# EAGLE board Poppy_IO_Core_v1.1 (EAGLE 7.3.0)
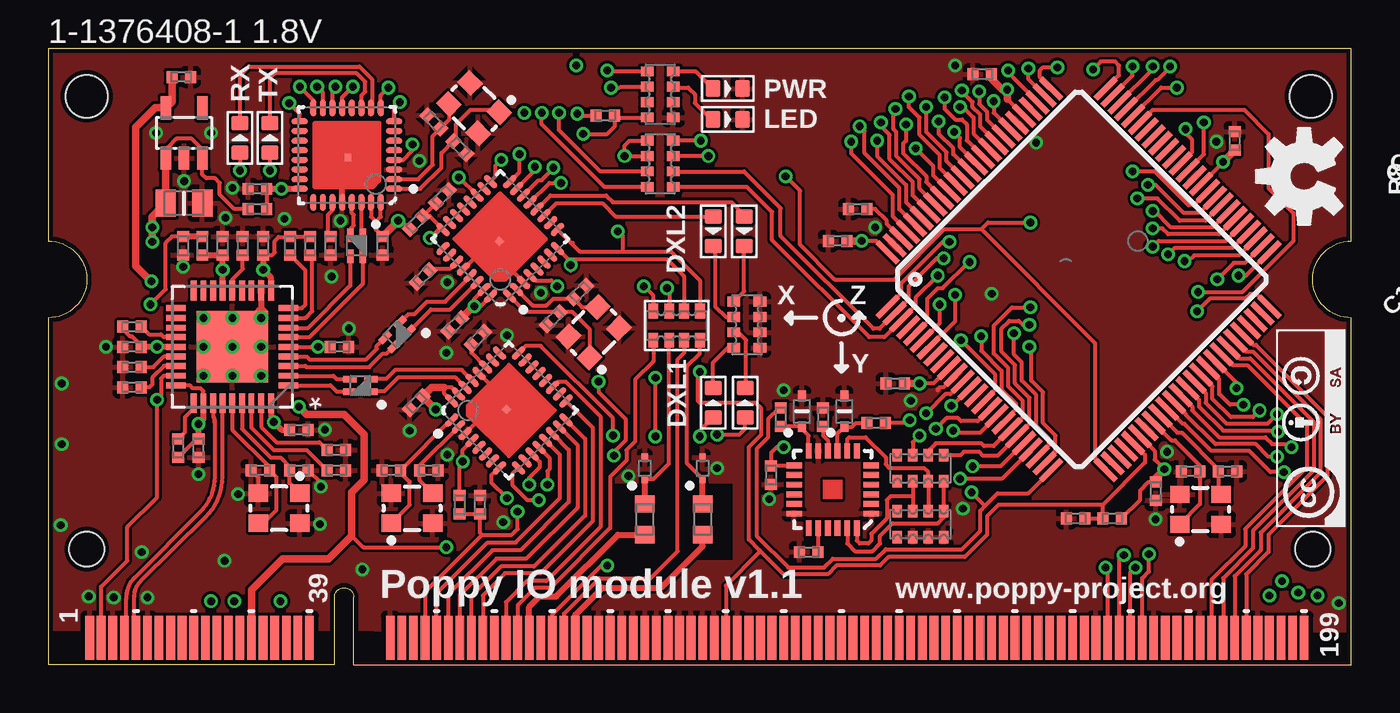
[diagram p2: board, top side]
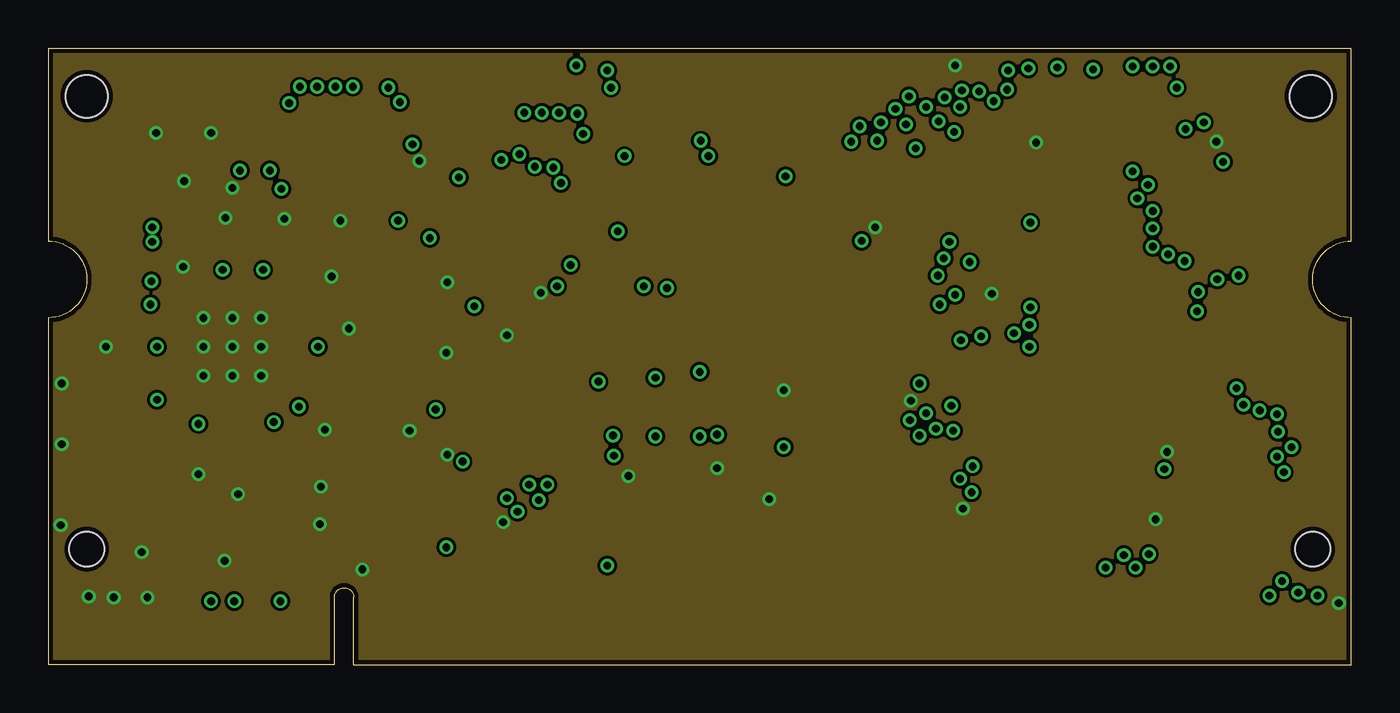
[diagram p3: board, inner layer Route2]
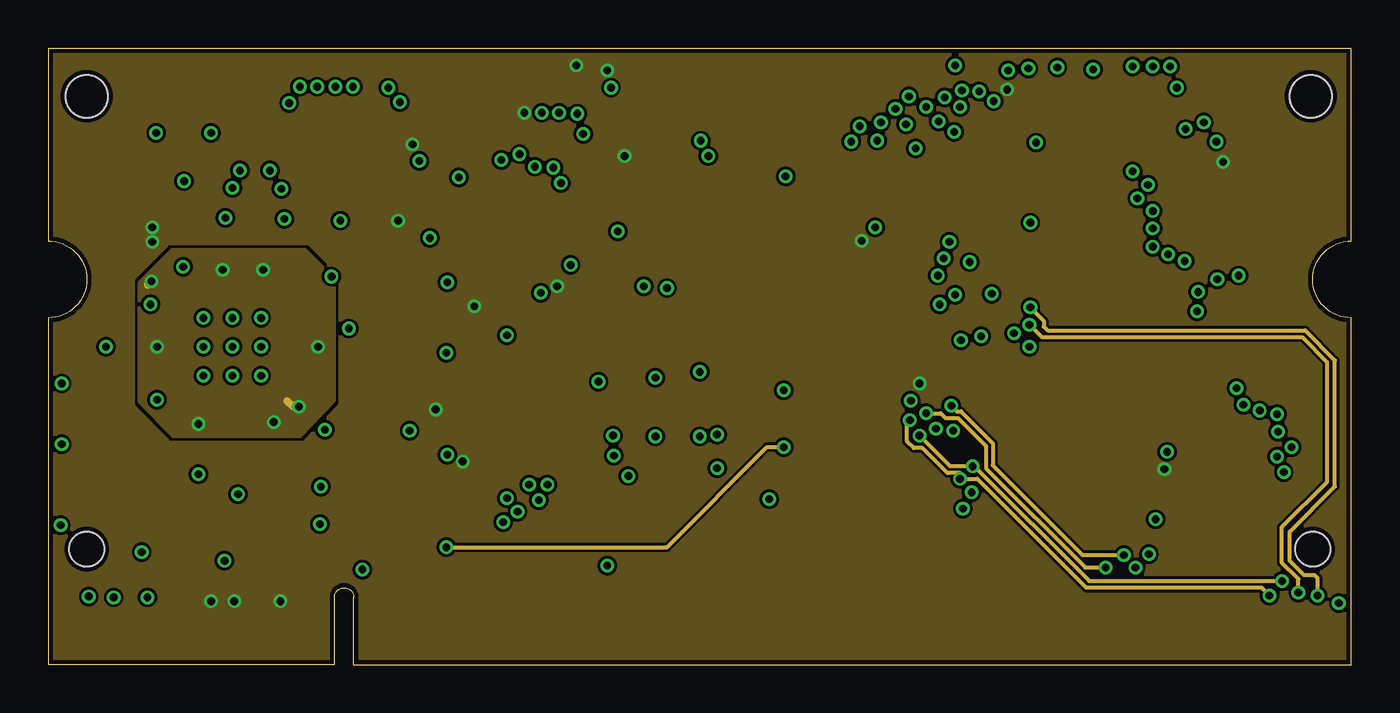
[diagram p4: board, inner layer Route15]
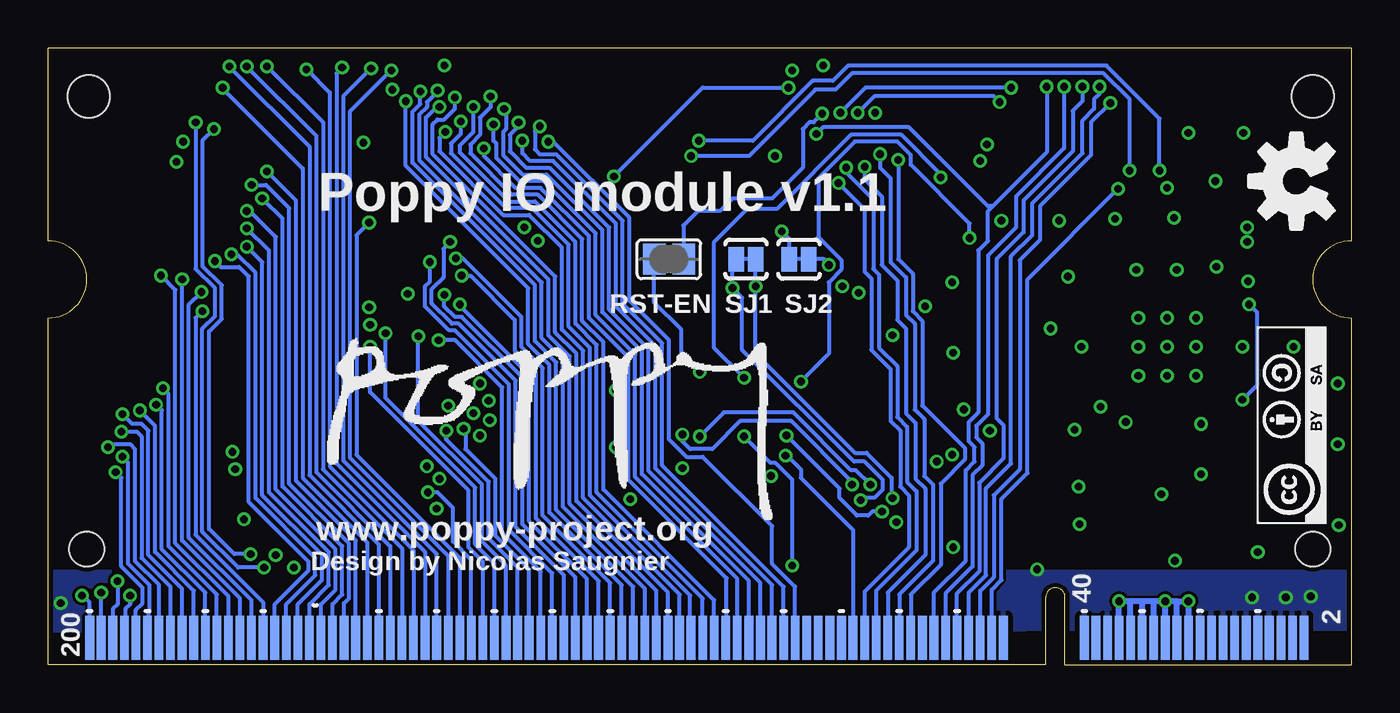
[diagram p5: board, bottom side, seen from below]

Size 67.6 x 32 mm. Coordinates in mm from the lower left corner, seen from the top.
Copper layers (1*2*15*16): Top 0.035mm / dielectric 0.2mm / Route2 0.0175mm / dielectric 1.1mm / Route15 0.0175mm / dielectric 0.2mm / Bottom 0.035mm
Design rules "SeeedStudio_DRU_no_angle_20130527 *": minimum track width 6mil, minimum drill 12mil, track to track 0.15mm, track to pad 0.15mm, pad to pad 0.15mm, via to via 0.15mm, smd to smd 0mil, copper to edge 0.25mm, drill to drill 0.25mm, minimum pad ring 6mil, minimum via ring 6mil, stop-mask expansion 2mil, vias tented up to drill 25mil, thermal gap 10mil
Net classes: 1 power: width 0.61 mm, drill 0.406 mm, clearance 0.203 mm; 2 gnd: width 0.305 mm, drill 0.406 mm, clearance 0.203 mm; 3 power usb: width 0.508 mm, drill 0.406 mm, clearance 0.203 mm
Holes 2.2 mm at 2,29.5 65.5,29.5
tKeepout: area -0.2,27.2 to 4.2,31.8; area 63.2,27.2 to 67.8,31.8
tRestrict: area 29.5,5.5 to 35.5,9.4

## Footprints (pad centres in the part's own frame; a part is rotated, then mirrored left to right if it is on the bottom)
0402_N = smd 0.57 x 0.62: 1 -0.48,0; 2 0.48,0
0805_N = smd 1.05 x 1.4: 1 -0.95,0; 2 0.95,0
SOD-923_N = smd 0.43 x 0.32: A 0.55,0; C -0.55,0
LED0603 = smd 0.762 x 0.889: + -0.762,0; - 0.762,0
SOD-523_N = smd 0.55 x 0.42: A 0.8,0; C -0.8,0
TQFP100 = smd 1.5 x 0.3: 1 -8,6; 2 -8,5.5; 3 -8,5; 4 -8,4.5; 5 -8,4; 6 -8,3.5; 7 -8,3; 8 -8,2.5; 9 -8,2; 10 -8,1.5; 11 -8,1; 12 -8,0.5; 13 -8,0; 14 -8,-0.5; 15 -8,-1; 16 -8,-1.5; 17 -8,-2; 18 -8,-2.5; 19 -8,-3; 20 -8,-3.5; 21 -8,-4; 22 -8,-4.5; 23 -8,-5; 24 -8,-5.5; 25 -8,-6; 51 8,-6; 52 8,-5.5; 53 8,-5; 54 8,-4.5; 55 8,-4; 56 8,-3.5; 57 8,-3; 58 8,-2.5; 59 8,-2; 60 8,-1.5; 61 8,-1; 62 8,-0.5; 63 8,0; 64 8,0.5; 65 8,1; 66 8,1.5; 67 8,2; 68 8,2.5; 69 8,3; 70 8,3.5; 71 8,4; 72 8,4.5; 73 8,5; 74 8,5.5; 75 8,6 | smd 0.3 x 1.5: 26 -6,-8; 27 -5.5,-8; 28 -5,-8; 29 -4.5,-8; 30 -4,-8; 31 -3.5,-8; 32 -3,-8; 33 -2.5,-8; 34 -2,-8; 35 -1.5,-8; 36 -1,-8; 37 -0.5,-8; 38 0,-8; 39 0.5,-8; 40 1,-8; 41 1.5,-8; 42 2,-8; 43 2.5,-8; 44 3,-8; 45 3.5,-8; 46 4,-8; 47 4.5,-8; 48 5,-8; 49 5.5,-8; 50 6,-8; 76 6,8; 77 5.5,8; 78 5,8; 79 4.5,8; 80 4,8; 81 3.5,8; 82 3,8; 83 2.5,8; 84 2,8; 85 1.5,8; 86 1,8; 87 0.5,8; 88 0,8; 89 -0.5,8; 90 -1,8; 91 -1.5,8; 92 -2,8; 93 -2.5,8; 94 -3,8; 95 -3.5,8; 96 -4,8; 97 -4.5,8; 98 -5,8; 99 -5.5,8; 100 -6,8
SOT23-DBV = smd 0.55 x 1.2: 1 -0.95,-1.3; 2 0,-1.3; 3 0.95,-1.3; 4 0.95,1.3; 5 -0.95,1.3
CRYSTAL_MODEL-403_N = smd 1 x 0.9: P$1 -1.05,-0.75; P$2 1.1,-0.75; P$3 1.1,0.8; P$4 -1.05,0.8
ARRAY_0402_65P_2_N = smd 0.7 x 0.35: 1 -0.55,0.325; 2 -0.55,-0.325; 3 0.55,-0.325; 4 0.55,0.325
R1206-8 = smd 0.508 x 0.762: 1 -1.206,-0.762; 2 -0.381,-0.762; 3 0.381,-0.762; 4 1.206,-0.762; 5 1.206,0.762; 6 0.381,0.762; 7 -0.381,0.762; 8 -1.206,0.762
SJ = smd 1.168 x 1.6: 1 -0.762,0; 2 0.762,0
CAY16 = smd 0.5 x 0.65: 1 -1.2,-0.675; 2 -0.4,-0.675; 3 0.4,-0.675; 4 1.2,-0.675; 5 1.2,0.675; 6 0.4,0.675; 7 -0.4,0.675; 8 -1.2,0.675
CAT16 = smd 0.5 x 0.65: 1 -1.2,-0.675; 2 -0.4,-0.675; 3 0.4,-0.675; 4 1.2,-0.675; 5 1.2,0.675; 6 0.4,0.675; 7 -0.4,0.675; 8 -1.2,0.675
0603_N = smd 0.9 x 1: 1 -0.8,0; 2 0.8,0
SJ_2S-TRACE2 = smd 0.8 x 1.27: 1 -0.508,0; 2 0.508,0
QFN-32_50P_N = smd 0.85 x 0.3: 1 -2.45,1.75; 2 -2.45,1.25; 3 -2.45,0.75; 4 -2.45,0.25; 5 -2.45,-0.25; 6 -2.45,-0.75; 7 -2.45,-1.25; 8 -2.45,-1.75; 17 2.45,-1.75; 18 2.45,-1.25; 19 2.45,-0.75; 20 2.45,-0.25; 21 2.45,0.25; 22 2.45,0.75; 23 2.45,1.25; 24 2.45,1.75 | smd 0.3 x 0.85: 9 -1.75,-2.45; 10 -1.25,-2.45; 11 -0.75,-2.45; 12 -0.25,-2.45; 13 0.25,-2.45; 14 0.75,-2.45; 15 1.25,-2.45; 16 1.75,-2.45; 25 1.75,2.45; 26 1.25,2.45; 27 0.75,2.45; 28 0.25,2.45; 29 -0.25,2.45; 30 -0.75,2.45; 31 -1.25,2.45; 32 -1.75,2.45 | smd 0.35 x 0.35: 33 -0.05,0.13
QFN-24 = smd 0.8 x 0.3: 1 -2,1.25; 2 -2,0.75; 3 -2,0.25; 4 -2,-0.25; 5 -2,-0.75; 6 -2,-1.25; 13 2,-1.25; 14 2,-0.75; 15 2,-0.25; 16 2,0.25; 17 2,0.75; 18 2,1.25 | smd 0.3 x 0.8: 7 -1.25,-2; 8 -0.75,-2; 9 -0.25,-2; 10 0.25,-2; 11 0.75,-2; 12 1.25,-2; 19 1.25,2; 20 0.75,2; 21 0.25,2; 22 -0.25,2; 23 -0.75,2; 24 -1.25,2
QFN50P600X600X100-37N = smd 1.016 x 0.305: 1 -2.921,2.007; 2 -2.921,1.499; 3 -2.921,0.991; 4 -2.921,0.508; 5 -2.921,0; 6 -2.921,-0.508; 7 -2.921,-0.991; 8 -2.921,-1.499; 9 -2.921,-2.007; 19 2.921,-2.007; 20 2.921,-1.499; 21 2.921,-0.991; 22 2.921,-0.508; 23 2.921,0; 24 2.921,0.508; 25 2.921,0.991; 26 2.921,1.499; 27 2.921,2.007 | smd 0.305 x 1.016: 10 -2.007,-2.921; 11 -1.499,-2.921; 12 -0.991,-2.921; 13 -0.508,-2.921; 14 0,-2.921; 15 0.508,-2.921; 16 0.991,-2.921; 17 1.499,-2.921; 18 2.007,-2.921; 28 2.007,2.921; 29 1.499,2.921; 30 0.991,2.921; 31 0.508,2.921; 32 0,2.921; 33 -0.508,2.921; 34 -0.991,2.921; 35 -1.499,2.921; 36 -2.007,2.921 | smd 3.708 x 3.708: 37 0,0
DDR1 = smd 0.45 x 2.3: 1 2.15,1.4; 3 2.75,1.4; 5 3.35,1.4; 7 3.95,1.4; 9 4.55,1.4; 11 5.15,1.4; 13 5.75,1.4; 15 6.35,1.4; 17 6.95,1.4; 19 7.55,1.4; 21 8.15,1.4; 23 8.75,1.4; 25 9.35,1.4; 27 9.95,1.4; 29 10.55,1.4; 31 11.15,1.4; 33 11.75,1.4; 35 12.35,1.4; 37 12.95,1.4; 39 13.55,1.4; 41 17.75,1.4; 43 18.35,1.4; 45 18.95,1.4; 47 19.55,1.4; 49 20.15,1.4; 51 20.75,1.4; 53 21.35,1.4; 55 21.95,1.4; 57 22.55,1.4; 59 23.15,1.4; 61 23.75,1.4; 63 24.35,1.4; 65 24.95,1.4; 67 25.55,1.4; 69 26.15,1.4; 71 26.75,1.4; 73 27.35,1.4; 75 27.95,1.4; 77 28.55,1.4; 79 29.15,1.4; 81 29.75,1.4; 83 30.35,1.4; 85 30.95,1.4; 87 31.55,1.4; 89 32.15,1.4; 91 32.75,1.4; 93 33.35,1.4; 95 33.95,1.4; 97 34.55,1.4; 99 35.15,1.4; 101 35.75,1.4; 103 36.35,1.4; 105 36.95,1.4; 107 37.55,1.4; 109 38.15,1.4; 111 38.75,1.4; 113 39.35,1.4; 115 39.95,1.4; 117 40.55,1.4; 119 41.15,1.4; 121 41.75,1.4; 123 42.35,1.4; 125 42.95,1.4; 127 43.55,1.4; 129 44.15,1.4; 131 44.75,1.4; 133 45.35,1.4; 135 45.95,1.4; 137 46.55,1.4; 139 47.15,1.4; 141 47.75,1.4; 143 48.35,1.4; 145 48.95,1.4; 147 49.55,1.4; 149 50.15,1.4; 151 50.75,1.4; 153 51.35,1.4; 155 51.95,1.4; 157 52.55,1.4; 159 53.15,1.4; 161 53.75,1.4; 163 54.35,1.4; 165 54.95,1.4; 167 55.55,1.4; 169 56.15,1.4; 171 56.75,1.4; 173 57.35,1.4; 175 57.95,1.4; 177 58.55,1.4; 179 59.15,1.4; 181 59.75,1.4; 183 60.35,1.4; 185 60.95,1.4; 187 61.55,1.4; 189 62.15,1.4; 191 62.75,1.4; 193 63.35,1.4; 195 63.95,1.4; 197 64.55,1.4; 199 65.15,1.4 | smd 0.45 x 2.3 bottom: 2 2.45,1.4; 4 3.05,1.4; 6 3.65,1.4; 8 4.25,1.4; 10 4.85,1.4; 12 5.45,1.4; 14 6.05,1.4; 16 6.65,1.4; 18 7.25,1.4; 20 7.85,1.4; 22 8.45,1.4; 24 9.05,1.4; 26 9.65,1.4; 28 10.25,1.4; 30 10.85,1.4; 32 11.45,1.4; 34 12.05,1.4; 36 12.65,1.4; 38 13.25,1.4; 40 13.85,1.4; 42 18.05,1.4; 44 18.65,1.4; 46 19.25,1.4; 48 19.85,1.4; 50 20.45,1.4; 52 21.05,1.4; 54 21.65,1.4; 56 22.25,1.4; 58 22.85,1.4; 60 23.45,1.4; 62 24.05,1.4; 64 24.65,1.4; 66 25.25,1.4; 68 25.85,1.4; 70 26.45,1.4; 72 27.05,1.4; 74 27.65,1.4; 76 28.25,1.4; 78 28.85,1.4; 80 29.45,1.4; 82 30.05,1.4; 84 30.65,1.4; 86 31.25,1.4; 88 31.85,1.4; 90 32.45,1.4; 92 33.05,1.4; 94 33.65,1.4; 96 34.25,1.4; 98 34.85,1.4; 100 35.45,1.4; 102 36.05,1.4; 104 36.65,1.4; 106 37.25,1.4; 108 37.85,1.4; 110 38.45,1.4; 112 39.05,1.4; 114 39.65,1.4; 116 40.25,1.4; 118 40.85,1.4; 120 41.45,1.4; 122 42.05,1.4; 124 42.65,1.4; 126 43.25,1.4; 128 43.85,1.4; 130 44.45,1.4; 132 45.05,1.4; 134 45.65,1.4; 136 46.25,1.4; 138 46.85,1.4; 140 47.45,1.4; 142 48.05,1.4; 144 48.65,1.4; 146 49.25,1.4; 148 49.85,1.4; 150 50.45,1.4; 152 51.05,1.4; 154 51.65,1.4; 156 52.25,1.4; 158 52.85,1.4; 160 53.45,1.4; 162 54.05,1.4; 164 54.65,1.4; 166 55.25,1.4; 168 55.85,1.4; 170 56.45,1.4; 172 57.05,1.4; 174 57.65,1.4; 176 58.25,1.4; 178 58.85,1.4; 180 59.45,1.4; 182 60.05,1.4; 184 60.65,1.4; 186 61.25,1.4; 188 61.85,1.4; 190 62.45,1.4; 192 63.05,1.4; 194 63.65,1.4; 196 64.25,1.4; 198 64.85,1.4; 200 65.45,1.4 | hole 1.8: 2,6; 65.6,6

## Placement (x,y rotation side)
C1  1uF  [0402_N]  21.1,17.65 225 top
C2  1uF  [0402_N]  57.45,9 270 top
C3  0.1uF  [0402_N]  42,23.65 0 top
C4  1uF  [0402_N]  22.3,16.95 45 top
C5  18pF  [0402_N]  17.8,10.1 0 top
C6  18pF  [0402_N]  19.75,10.1 180 top
C7  1uF  [0402_N]  19.45,20.15 225 top
C8  1uF  [0402_N]  61.55,27.2 90 top
C9  1uF  [0402_N]  40.95,22 180 top
C10  18pF  [0402_N]  53.3,7.6 180 top
C11  4.7uF  [0805_N]  7.05,23.95 0 top
C12  1uF  [0402_N]  17.35,21.75 270 top
C13  1uF  [0402_N]  6.9,30.5 0 top
C14  0.1uF  [0402_N]  28.9,28.5 180 top
C15  18pF  [0402_N]  26.21,17.97 45 top
C16  18pF  [0402_N]  27.59,19.34 225 top
C17  1uF  [0402_N]  14.65,21.75 90 top
C18  18pF  [0402_N]  21.35,26.84 315 top
C19  18pF  [0402_N]  20.01,28.18 135 top
C20  1uF  [0402_N]  19.1,13.6 225 top
C21  1uF  [0402_N]  37.5,9.85 270 top
C22  2.2nF  [0402_N]  39.45,5.85 180 top
C23  0.1uF  [0402_N]  40.2,12.85 90 top
C24  18pF  [0402_N]  61.18,10.05 0 top
C25  18pF  [0402_N]  59.26,10.05 180 top
C26  18pF  [0402_N]  11,10.1 180 top
C27  18pF  [0402_N]  13,10.1 180 top
C28  1uF  [0402_N]  11.15,21.75 90 top
C29  0.1uF  [0402_N]  14.95,10.1 0 top
C30  0.1uF  [0402_N]  10.1,21.75 90 top
C31  1uF  [0402_N]  7.8,11.25 270 top
C32  1uF  [0402_N]  4.35,16.5 180 top
C33  1uF  [0402_N]  9.05,21.75 90 top
C34  1uF  [0402_N]  15.1,16.5 0 top
C35  1uF  [0402_N]  13,12.2 0 top
C36  1uF  [0402_N]  7,21.75 270 top
C37  1uF  [0402_N]  43.95,14.6 180 top
C38  1uF  [0402_N]  48.45,30.65 180 top
C39  1uF  [0402_N]  10.85,24.7 180 top
C40  0.1uF  [0402_N]  20.45,24.3 45 top
C41  0.1uF  [0402_N]  22.4,8.3 90 top
D1  5.1V  [SOD-923_N]  30.95,10.2 90 top
D2  Red  [LED0603]  36.15,13.6 90 top
D3  Green  [LED0603]  34.5,13.6 90 top
D4  5.1V  [SOD-923_N]  33.95,10.2 90 top
D5  Yellow  [LED0603]  9.95,27.35 90 top
D6  Yellow  [LED0603]  11.5,27.35 90 top
D7  Red  [LED0603]  36.1,22.5 270 top
D8  Green  [LED0603]  34.5,22.5 270 top
D9  Yellow  [LED0603]  35.25,28.3 0 top
D10  Blue  [LED0603]  35.25,29.9 0 top
D11  3.3V  [SOD-523_N]  41.3,13.15 90 top
D12  3.3V  [SOD-523_N]  39.1,13.15 90 top
IC3  ATMEGA2560-16AU  [TQFP100]  53.45,20 45 top
IC6  LP2985-33DBVR  [SOT23-DBV]  7.05,27.6 0 top
Q1  16MHz  [CRYSTAL_MODEL-403_N]  18.85,8.1 0 top
Q2  16MHz  [CRYSTAL_MODEL-403_N]  59.75,8.04 0 top
Q3  16MHz  [CRYSTAL_MODEL-403_N]  22.13,28.89 135 top
Q4  16MHz  [CRYSTAL_MODEL-403_N]  28.29,17.22 45 top
Q5  24MHz  [CRYSTAL_MODEL-403_N]  12,8.15 180 top
R1  22R  [ARRAY_0402_65P_2_N]  16.2,14.5 180 top
R2  150R  [R1206-8]  32.6,17.6 180 top
R3  22R  [ARRAY_0402_65P_2_N]  18.1,17.15 225 top
R4  470R  [0402_N]  42.95,12.55 0 top
R5  10k  [0402_N]  12.55,21.75 90 top
R6  12k 1%  [0402_N]  14.95,11.15 0 top
R7  10k  [0402_N]  13.6,21.75 270 top
R8  100k  [0402_N]  8,21.75 90 top
R9  100k  [0402_N]  6.75,11.25 90 top
R10  100k  [0402_N]  4.35,17.55 0 top
R11  100k  [0402_N]  4.35,14.4 180 top
R12  100k  [0402_N]  4.35,15.45 0 top
R13  22R  [ARRAY_0402_65P_2_N]  16,21.75 270 top
R14  470R  [0402_N]  38,12.85 90 top
R15  10k  [0402_N]  55.2,7.6 180 top
R16  10k  [0402_N]  21.35,8.3 270 top
R17  10k  [0402_N]  19.1,22.95 45 top
R18  10k  [0402_N]  10.85,23.65 0 top
RESET-EN  [SJ]  35.4,21.05 0 bottom
RN1  1k  [CAY16]  36.25,17.65 90 top
RN2  10K  [CAT16]  45.25,10.2 0 top
RN3  1k  [CAY16]  31.75,29.6 270 top
RN4  1k  [CAY16]  31.75,26 90 top
RN6  20K  [CAT16]  45.25,7.3 180 top
RPTC1  100R  [0603_N]  30.95,7.55 270 top
RPTC2  100R  [0603_N]  33.95,7.55 270 top
SJ1  SOLDERJUMPER2_TRACE2  [SJ_2S-TRACE2]  31.4,21.05 180 bottom
SJ2  SOLDERJUMPER2_TRACE2  [SJ_2S-TRACE2]  28.65,21.05 180 bottom
U1  ATmega16u2  [QFN-32_50P_N]  23.9,13.2 45 top
U2  MPU-6000  [QFN-24]  40.7,9.1 180 top
U3  USB2514B-AEZC  [QFN50P600X600X100-37N]  9.55,16.5 180 top
U4  ATmega16u2  [QFN-32_50P_N]  23.45,22.1 135 top
U5  ATmega16u2  [QFN-32_50P_N]  15.5,26.45 180 top
U$1  [OSHW-LOGO-M]  65.15,25.35 90 top
U$2  [CC-BY-SA]  65.05,12.45 90 top
U$3  [OSHW-LOGO-M]  2.85,25.1 90 bottom
U$4  [CC-BY-SA]  3.55,12.6 90 bottom
X1  1376408-DDR1  [DDR1]  0,0 0 top

## Tracks (layer width: path | path; a pad name or v marks a point on that pad's centre or on a via)
!CS_3V3
  Top 0.2: U2.8 41.45,11.7 41.55,11.8 42.4,11.8 43.45,10.75 43.45,10.4 43.65,10.2 45.45,10.2 45.65,10 RN2.3 RN6.2
+3V3  (via drill 0.4)
  Top 0.2: U3.5 v14,16.5 C34.1 | C28.1 11.62,21.27 11.75,21.4 11.75,22 11.95,22.2 12.52,22.2 R5.2 R7.1 | U3.29 8.05,14.2 7.9,14.35 7.5,14.35 7.36,14.49 U3.27 | R10.1 3.87,17.43 4.25,17.05 4.35,17.05 4.83,16.57 C32.1 | R9.1 7.71,11.73 C31.1 | 15.75,6.7 16.35,6.1 v20.65,6.1 | U2.13 38.68,10.33 C21.1 37.5,11 37.8,11.3 v38.15,11.3
  Top 0.3: R8.1 C33.1 v9.05,20.5 v9.04,20.49 U3.15 | U3.10 11.56,20.09 v11.15,20.5 C28.1 | U3.23 v5.65,16.5 C32.1 | C31.1 v7.8,12.5 8.05,12.75 U3.29 | U3.36 11.56,12.74 v11.7,12.6 12.1,12.2 C35.1
  Top 0.4: X1.29 10.55,3.9 12.15,5.5 14.55,5.5 15.75,6.7 15.75,8.95 16.4,9.6 16.4,11.95 15.35,13 13.4,13 v13,13.4 | C13.1 6.42,29.22 IC6.5 5.55,28.9 4.55,27.9 4.55,20.7 v5.35,19.9
  Route15 0.2: v20.65,6.1 32.1,6.1 37.3,11.3 v38.15,11.3
  Route15 0.4: v13,13.4 12.7,13.4 12.4,13.7 | v5.35,19.9 5.3,19.9 5.15,19.75 5.15,19.7
  pour Route15: 6.45,21.55 13.3,21.55 14.8,20.05 14.8,13.7 13.05,11.85 6.5,11.85 4.75,13.65 4.75,19.85
+5V  (via drill 0.4)
  Top 0.2: 19.44,13.91 C20.1 | U1.32 20.55,14.07 20.55,14.4 20.93,14.4 U1.31 | U1.4 21.5,11.15 v21.5,10.55 21.35,10.4 R16.1 | U4.31 22.1,18.98 v22.1,18.6 22.43,18.6 U4.32 | U4.4 25.25,19.95 26.1,19.95 v26.4,19.65 | IC6.1 6.2,26.4 6.2,26.85 6.65,27.3 7.45,27.3 8,26.75 IC6.3 8,25.45 8.2,25.25 8.65,25.25 8.9,25 8.9,24.4 9.65,23.65 R18.1 | U5.31 16.75,23.25 17,23 | 17,23 17.25,23.25 U5.32 | C12.1 17,22.58 17,23 | U5.4 18.4,26.2 18.9,26.7 v18.9,27 | 18.15,23.03 18.34,23.03 R17.1 | IC3.31 57.4,11.1 57.4,10.65 v57.9,10.15 | IC3.10 45.93,14.6 v45.2,14.6 | IC3.100 42.97,22 v42.2,22 | IC3.80 49.76,29.35 | IC3.61 60.95,26.09 v60.95,26.1 | R15.1 56.65,8.57 56.65,9.05 57.08,9.48 C2.1 | RN4.6 v29.9,26.4 29.9,26.95 30.15,27.2 RN4.5 | v29,30.85 29.05,30.8 RN3.1
  Top 0.4: C20.1 19.9,14.4 20.55,14.4 | 19.44,13.91 v20.1,13.25 | v22.1,18.6 22.05,18.6 C1.1 | IC6.1 C11.1 5.4,23.25 v5.4,22.7 v5.4,21.95 | C12.1 18.15,23.03 v18.15,23.05 | C2.1 57.45,9.7 v57.9,10.15 | C8.1 61.55,26.7 v60.95,26.1 | v42.2,22 C9.1 | v45.2,14.6 C37.1 | 49.76,29.35 v49.76,29.84 v49.75,29.85 49.5,29.85 48.95,30.4 48.95,30.63 C38.1
  Bottom 0.3: X1.34 v12.05,3.3 11.45,3.3 | X1.32 11.45,3.3 | X1.30 10.85,3.3 | X1.28 10.25,3.3 | X1.26 v9.65,3.3 | X1.24 9.05,3.3 | 9.05,3.3 v8.45,3.3 X1.22 | 9.05,3.3 v9.65,3.3 | v9.65,3.3 10.25,3.3 | 10.25,3.3 10.85,3.3 | 10.85,3.3 11.45,3.3
  other vias: 27.4,31.1 24.7,28.65
  pour Route15 (rank 2): 0,31.75 67.6,31.75 67.6,0 0,0
ADC0  (via drill 0.4)
  Top 0.2: v41.65,27.15 41.65,26.55 43.8,24.4 43.8,23.29 IC3.97
  Bottom 0.2: X1.78 28.85,4.05 30.05,5.25 30.05,7.2 33.65,10.8 34.5,10.8 35.4,11.7 35.4,16.85 37.45,18.9 37.45,23.2 41.4,27.15 v41.65,27.15
ADC1  (via drill 0.4)
  Top 0.2: IC3.96 44.15,23.64 44.15,24.75 42.35,26.55 42.35,27.7 v42.1,27.95
  Bottom 0.2: X1.80 29.45,4.05 35.75,10.35 35.75,16.7 37.8,18.75 37.8,23.05 41.25,26.5 42.1,26.5 42.35,26.75 42.35,27.7 v42.1,27.95
ADC2  (via drill 0.4)
  Top 0.2: v43,27.2 43,26.4 44.5,24.9 44.5,24 IC3.95
  Bottom 0.2: X1.82 30.05,4.15 36.1,10.2 36.1,16.55 38.15,18.6 38.15,22.9 41.4,26.15 42.6,26.15 43,26.55 v43,27.2
ADC3  (via drill 0.4)
  Top 0.2: IC3.94 44.85,24.36 44.85,25.05 43.65,26.25 43.65,27.5 43.2,27.95 v43.2,28.15
  Bottom 0.2: X1.84 30.65,4.25 36.45,10.05 36.45,16.4 38.5,18.45 38.5,22.7 41.6,25.8 42.8,25.8 43.65,26.65 43.65,27.5 43.2,27.95 v43.2,28.15
ADC4  (via drill 0.4)
  Top 0.2: IC3.93 45.2,24.71 45.2,25.2 44,26.4 44,27.65 43.85,27.8 43.85,28.5 43.95,28.6 v43.95,28.85
  Bottom 0.2: X1.86 31.25,4.35 36.8,9.9 36.8,16.25 38.85,18.3 38.85,22.55 41.75,25.45 43,25.45 44,26.45 44,27.65 43.85,27.8 43.85,28.75 v43.95,28.85
ADC5  (via drill 0.4)
  Top 0.2: v44.5,28.05 44.5,27.2 44.35,27.05 44.35,26.55 45.55,25.35 45.55,25.05 46.36,24.24 IC3.92
  Bottom 0.2: X1.88 31.85,4.45 37.15,9.75 37.15,16.1 39.2,18.15 39.2,22.4 41.9,25.1 43.15,25.1 44.35,26.3 44.35,27.05 44.5,27.2 v44.5,28.05
ADC6  (via drill 0.4)
  Top 0.2: v45,26.8 45.9,25.9 45.9,25.4 46.7,24.6 IC3.91
  Bottom 0.2: X1.90 32.4,1.45 32.4,4.5 37.5,9.6 37.5,15.95 39.55,18 39.55,22.25 42.05,24.75 43.35,24.75 45,26.4 v45,26.8
ADC7  (via drill 0.4)
  Top 0.2: IC3.90 46.25,25.79 46.25,26.45 45.2,27.5 45.2,28.4 44.65,28.95 v44.65,29.5
  Bottom 0.2: X1.92 33.05,3.35 38.8,9.1 38.8,16.75 39.9,17.85 39.9,22.1 42.2,24.4 43.55,24.4 45.7,26.55 45.7,27 45.2,27.5 45.2,28.4 44.65,28.95 v44.65,29.5
ADC8  (via drill 0.4)
  Top 0.2: IC3.89 46.6,26.14 46.6,26.6 45.55,27.65 v45.55,28.95
  Bottom 0.2: X1.94 33.65,3.45 39.15,8.95 39.15,16.6 40.25,17.7 40.25,21.95 42.35,24.05 43.7,24.05 46.25,26.6 46.25,26.95 45.55,27.65 v45.55,28.95
ADC9  (via drill 0.4)
  Top 0.2: IC3.88 46.95,26.5 46.95,26.8 46.2,27.55 v46.2,28.2
  Bottom 0.2: X1.96 34.3,1.45 34.3,3.6 39.5,8.8 39.5,16.45 40.6,17.55 40.6,21.8 42.5,23.7 43.85,23.7 46.7,26.55 46.7,27.05 46.2,27.55 v46.2,28.2
ADC10  (via drill 0.4)
  Top 0.2: IC3.87 47.3,26.86 47.3,27.35 v47,27.65
  Bottom 0.2: X1.98 34.85,3.65 39.85,8.65 39.85,16.3 40.95,17.4 40.95,21.65 42.65,23.35 44,23.35 47.3,26.65 47.3,27.35 v47,27.65
ADC11  (via drill 0.4)
  Top 0.2: v46.5,29.45 46.5,28.85 47.05,28.3 47.4,28.3 47.65,28.05 47.65,27.21 IC3.86
  Bottom 0.2: X1.100 35.45,3.75 40.2,8.5 40.2,16.15 41.3,17.25 41.3,20.15 47.65,26.5 47.65,28.05 47.4,28.3 47.05,28.3 46.5,28.85 v46.5,29.45
ADC12  (via drill 0.4)
  Top 0.2: v47.3,28.95 47.45,28.95 48,28.4 48,27.57 IC3.85
  Bottom 0.2: X1.102 36.05,3.85 40.55,8.35 40.55,16 41.65,17.1 41.65,20 48,26.35 48,28.4 47.45,28.95 v47.3,28.95
ADC13  (via drill 0.4)
  Top 0.2: IC3.84 48.35,27.93 48.35,28.55 47.95,28.95 47.95,29.2 47.4,29.75 v47.4,29.8
  Bottom 0.2: X1.104 36.65,3.95 40.9,8.2 40.9,15.85 42,16.95 42,19.85 48.35,26.2 48.35,28.55 47.95,28.95 47.95,29.2 47.4,29.75 v47.4,29.8
ADC14  (via drill 0.4)
  Top 0.2: v48.3,29.75 48.3,29.1 48.7,28.7 48.7,28.29 IC3.83
  Bottom 0.2: X1.106 37.25,4.05 41.25,8.05 41.25,15.7 42.35,16.8 42.35,19.7 48.7,26.05 48.7,28.7 48.3,29.1 v48.3,29.75
ADC15  (via drill 0.4)
  Top 0.2: v49.05,29.25 49.05,28.64 IC3.82
  Bottom 0.2: X1.108 37.85,4.15 41.6,7.9 41.6,15.55 42.7,16.65 42.7,19.55 49.05,25.9 v49.05,29.25
AREF
  Top 0.2: IC3.98 43.5,22.88 43.5,23.05 42.9,23.65 C3.2
GND  (via drill 0.4)
  Top 0.2: v11.05,18 U3.37 | C26.2 10.9,9.72 Q5.P$2 | C27.1 14.15,9.43 v14.15,9.25 | U1.28 23.77,13.68 U1.33 | U1.3 22.59,12.95 22.8,12.95 | U4.28 22.97,21.97 U4.33 23.39,21.11 24.7,19.8 | IC3.11 46.44,14.4 46.25,14.4 46.15,14.3 46.15,14.25
  Top 0.3: U3.11 11.05,18.45 | 11.05,18.45 11.05,18.35 10.75,18.05 10.75,17.7 U3.37 | 11.05,18.45 11.1,18.45 11.25,18.3 | 11.05,18.45 11,18.45 10.75,18.2 | U5.28 15.25,26.02 U5.33
  other vias: 16.3,4.95 2.1,3.55 15.6,17.45 7.05,25.1 42.9,22.7 8.05,18 9.55,18 8.05,15 11.05,15 9.55,15 11.05,16.5 8.05,16.5 9.55,16.5 3,16.5 7.8,9.9 7,20.65 14.35,12.2 9.15,5.4 14.1,7.3 9.85,8.85 3.4,3.5 5.15,3.5 0.7,11.45 0.7,14.6 4.85,5.85 0.65,7.25 15.15,23.05 19.25,26.15 9.55,24.75 20.7,10.9 18.75,12.15 20.65,16.2 23.8,17.1 20.7,19.85 25.55,19.3 14.7,20.15 5.6,27.6 8.45,27.6 12.25,23.15 9.2,23.2 23.6,7.4 30.1,9.8 34.7,10.2 38.15,14.25 37.4,8.6 47.45,8.1 60.6,27.15 47.05,31.1 58.05,11.05 51.25,27.1 48.95,19.25 66.95,3.2 44.75,13.7 57.45,7.55
  pour Route2: 0,31.75 67.6,31.75 67.6,0 0,0
  pour Top: 0,31.75 67.6,31.75 67.6,1.75 0,1.85
  pour Bottom: 0,1.85 67.6,1.75 67.6,4.85 0,4.85
  pour Bottom: 0,1.85 67.6,1.75 67.6,4.3 0,4.3
HUB_RESET  (via drill 0.4)
  Top 0.2: C36.1 6.43,22.23 6.1,21.9 6.1,19.5 v5.3,18.7 | U3.26 6,15 5.85,14.85 5.85,13.95 v5.65,13.75 5.65,8.7 4.1,7.15 4.1,5.4 2.75,4.05 X1.3
  Top 0.3: R8.2 C36.1
  Bottom 0.2: v5.3,18.7 4.9,18.3 4.9,14.5 v5.65,13.75
L13  (via drill 0.4)
  Top 0.2: 48.4,22.6 46.5,22.6 43.9,20 40.8,20 39,21.8 39,24.6 v38.25,25.35 | 48.4,22.6 54.3,16.7 54.3,10.66 IC3.26 | 48.4,22.6 48.75,22.95 v50.95,22.95 | v29.2,29.95 29.65,29.95 29.7,30 RN3.2
  Bottom 0.2: v50.95,22.95 51.6,22.3 51.6,10.9 46.25,5.55 X1.136 | v38.25,25.35 33.65,29.95 v29.2,29.95
M8RXD  (via drill 0.4)
  Top 0.2: U5.9 17.25,29.55 v17.65,29.95 | RN4.7 28.65,25.6 26.5,27.75 v26.5,28.65
  Bottom 0.2: v17.65,29.95 25.2,29.95 v26.5,28.65
M8TXD  (via drill 0.4)
  Top 0.2: U5.8 17.95,28.9 v18.25,29.2 | RN4.8 28.85,24.8 25.6,28.05 v25.6,28.65
  Bottom 0.2: v18.25,29.2 18.55,29.5 24.75,29.5 v25.6,28.65
MEGA_RESET  (via drill 0.4)
  Top 0.2: IC3.30 56.9,10.89 56.9,10.5 54.7,8.3 | 36.9,5.95 38.15,4.7 40.45,4.7 40.9,5.15 43.15,5.15 43.6,5.6 47.55,5.6 48.7,6.75 48.7,7.7 49.3,8.3 54.7,8.3 | 36.9,5.95 36.35,6.5 36.35,11.3 37,11.95 37,13.3 36.7,13.6 33.8,13.6 33.7,13.7 33.7,15.1 v33.8,15.2 | X1.99 35.15,4.1 36.9,5.85 36.9,5.95 | C10.1 R15.2 54.7,7.62 54.7,8.3 | v27.45,28.6 27.55,28.5 C14.2
  Bottom 0.2: v33.8,15.2 34.75,16.15 34.75,17.4 36.16,18.81 RESET-EN.1 RESET-EN.2 34.65,21.06 34.65,22.8 33.9,23.55 32.75,23.55 32.1,24.2 30.05,24.2 28.45,25.8 28.45,27.8 28.1,28.15 27.9,28.15 v27.45,28.6
MISO_3V3
  Top 0.2: U2.9 40.95,12 D11.C 41.7,12.35 41.9,12.55 R4.1
MOSI_3V3
  Top 0.2: U2.24 41.95,6.45 42.1,6.3 42.55,6.3 42.7,6.45 42.7,6.8 43.5,7.6 43.5,8.55 43.7,8.75 44.85,8.75 | RN2.2 44.85,8.75 | 44.85,8.75 RN6.3
MPU_INT
  Top 0.2: U2.12 39.45,11.9 39.1,12.25 D12.C 38.93,12.37 R14.1
N$1
  Top 0.2: D8.- 34.6,21.64 34.6,18.6 35.15,18.05 RN1.6
N$2  (via drill 0.4)
  Top 0.2: v23.8,8.65 23,9.45 23,9.85 23.38,10.23 U1.8 | R2.4 31.39,19.16 v30.9,19.65
  Bottom 0.2: v23.8,8.65 23.85,8.7 23.85,9.7 25.15,11 25.75,11 30.9,16.15 v30.9,19.65 SJ1.1
N$3
  Top 0.2: U1.27 21.96,16.2 C4.1
N$4
  Top 0.2: D1.C 31.4,9.65 32.2,10.45 32.2,16.82 R2.6
  Top 0.3: RPTC1.1 D1.C
N$5  (via drill 0.4)
  Top 0.2: U1.11 25.5,10.54 25.5,10.25 24.95,9.7 v24.95,9.35 | v33.8,11.85 33.8,12.15 34.49,12.84 D3.+
  Bottom 0.2: v24.95,9.35 25.7,10.1 25.95,10.1 28.95,13.1 32.55,13.1 v33.8,11.85
N$6
  Top 0.2: RN3.8 33.59,30.8 D10.+
N$7
  Top 0.2: Q1.P$3 19.27,9.58 C6.2 19.27,10.34 U1.2
N$8
  Top 0.2: Q1.P$1 18.75,8.3 18.75,9.5 18.28,9.97 C5.2 20.89,12.71 U1.1
N$9
  Top 0.2: U1.30 21.14,14.9 18.15,14.9 17.45,14.2 16.77,14.2 R1.1
N$10
  Top 0.2: U1.29 21.45,15.3 18,15.3 17.55,14.85 16.77,14.85 R1.2
N$11
  Top 0.2: RN1.5 36.1,19.38 D7.-
N$12
  Top 0.2: D2.- 36.2,14.41 36.2,16.85 35.8,17.25 RN1.7
N$13
  Top 0.2: D3.- 34.5,15.7 35.25,16.45 RN1.8
N$14  (via drill 0.4)
  Top 0.2: U4.9 27.2,21.81 | 27.2,21.81 27.57,21.45 29.8,21.45 | 29.8,21.45 32.3,21.45 33.81,19.94 R2.1 | 27.2,21.81 27.2,21.9 | v29.55,22.5 29.8,22.25 29.8,21.45
  Bottom 0.2: SJ2.2 29.15,22.1 v29.55,22.5
N$15  (via drill 0.4)
  Top 0.2: U1.12 26,10.75 26,10.15 25.9,10.05 v25.9,9.35 | v34.7,11.95 35.85,11.95 36.15,12.25 D2.+
  Bottom 0.2: v25.9,9.35 25.9,9.5 29.05,12.65 31.7,12.65 33.15,11.2 34.3,11.2 34.7,11.6 v34.7,11.95
N$16
  Top 0.2: RN3.7 32.48,29.95 33.2,29.95 33.55,29.6 33.55,29.15 34.4,28.3 D9.+
N$17
  Top 0.2: U4.27 20.84,20.55 19.85,20.55 C7.1
N$18
  Top 0.2: U4.2 25.13,18.65 25.85,18.65 26.2,19 C16.2 27.69,18.57 Q4.P$3
N$19
  Top 0.2: U4.1 24.77,18.3 C15.2 27.2,18.3 28.1,17.4 28.1,15.97 Q4.P$1
N$20  (via drill 0.4)
  Top 0.2: 24.35,10.19 U1.9 24.1,9.94 24.1,9.3 24.85,8.55 v25.45,8.55 | v32.1,19.55 32.22,19.43 R2.3
  Bottom 0.2: v25.45,8.55 25.3,8.7 24.7,8.7 24.3,9.1 24.3,9.6 25.25,10.55 25.8,10.55 31.6,16.35 31.6,19.05 v32.1,19.55 32.1,20.86 SJ1.2
N$21  (via drill 0.4)
  Top 0.2: U4.8 26.98,21.05 27.1,21.05 | 27.1,21.05 32.1,21.05 32.98,20.17 R2.2 | 27.1,20.45 v27.1,20.75 27.1,21.05
  Bottom 0.2: v27.1,20.75 27.1,20.8 27.35,21.05 SJ2.1
N$22
  Top 0.2: D4.C 33.15,10.45 33.15,15.5 33.81,16.16 R2.8
  Top 0.3: RPTC2.1 D4.C
N$23
  Top 0.2: R3.1 19.86,18.45 20.85,18.45 22.24,19.84 U4.30
N$24
  Top 0.2: R3.2 18.69,18.2 19,18.2 19.65,18.85 20.6,18.85 21.89,20.14 U4.29
N$27
  Top 0.2: U4.11 26.36,23.95 28.75,23.95 29.44,23.26 D8.+
N$28
  Top 0.2: U4.12 26.05,24.35 28.95,24.35 29.3,24 35.45,24 36.1,23.35 D7.+
N$31
  Top 0.2: C23.1 40.2,11.9 40.45,11.65 U2.10
N$32
  Top 0.2: Q5.P$3 11.15,7.35 11.85,8.05 11.85,9.73 C26.1 11.48,10.27 9.55,12.2 U3.32
N$33
  Top 0.2: C22.1 39.95,5.87 U2.20
N$34
  Top 0.2: U3.8 13.35,18 13.7,18.35 13.7,21.17 R7.2
N$35
  Top 0.2: Q5.P$1 12.52,9.43 C27.2 12.52,10.28 12.05,10.75 11.55,10.75 10.06,12.24 U3.33
N$36
  Top 0.2: U3.9 13.16,18.51 13.35,18.7 13.35,20.47 R5.1
N$38
  Top 0.2: U3.14 9.55,20 10.1,20.55 C30.1
N$39
  Top 0.2: R9.2 7.1,12.08 7.1,12.85 7.54,13.29 U3.28
N$40
  Top 0.2: U3.34 10.54,12.31 11.7,11.15 13.42,11.15 C29.1
N$41
  Top 0.2: U3.35 11.05,12.35 11.85,11.55 14.07,11.55 R6.1
N$42
  Top 0.2: U3.22 5.99,17.01 5.85,17.15 5.23,17.15 R10.2
N$43
  Top 0.2: U3.24 5.99,15.99 5.45,15.45 R12.2
N$44
  Top 0.2: U3.25 6.01,15.51 5.4,14.9 5.4,14.55 5.25,14.4 R11.1
N$54  (via drill 0.4)
  Top 0.2: D5.+ v9.95,25.65 | v33.85,27.2 RN4.4
  Bottom 0.2: v9.95,25.65 9.95,28.35 12.7,31.1 26.1,31.1 26.9,30.3 27.95,30.3 31.05,27.2 v33.85,27.2
N$55  (via drill 0.4)
  Top 0.2: D6.+ v11.5,25.65 | v34.25,26.4 RN4.3
  Bottom 0.2: v11.5,25.65 11.5,29.35 12.85,30.7 25.9,30.7 26.75,29.85 27.8,29.85 31.25,26.4 v34.25,26.4
PA0  (via drill 0.4)
  Top 0.2: IC3.78 49.8,30.72 v49.8,30.85
  Bottom 0.2: v49.8,30.85 51.95,28.7 51.95,10.75 46.85,5.65 X1.138
PA1  (via drill 0.4)
  Top 0.2: IC3.77 50.85,30.38 v50.85,30.95
  Bottom 0.2: v50.85,30.95 52.3,29.5 52.3,10.6 47.45,5.75 X1.140
PA2  (via drill 0.4)
  Top 0.2: IC3.76 51.45,30.48 51.45,30.85 51.6,31 v52.35,31
  Bottom 0.2: v52.35,31 52.65,30.7 52.65,10.45 48.05,5.85 X1.142
PA3  (via drill 0.4)
  Top 0.2: IC3.75 55.55,30.59 55.55,31.1 55.35,31.3 54.6,31.3 v54.2,30.9
  Bottom 0.2: v54.2,30.9 53,29.7 53,10.3 48.65,5.95 X1.144
PA4  (via drill 0.4)
  Top 0.2: IC3.74 56.25,30.58 v56.25,31.05
  Bottom 0.2: v56.25,31.05 53.35,28.15 53.35,10.15 49.25,6.05 X1.146
PA5  (via drill 0.4)
  Top 0.2: IC3.73 57.3,30.92 v57.3,31.05
  Bottom 0.2: v57.3,31.05 53.7,27.45 53.7,10 49.85,6.15 X1.148
PA6  (via drill 0.4)
  Top 0.2: IC3.72 55.94,28.84 57.45,30.35 57.54,30.35 58.2,31.01 v58.2,31.05
  Bottom 0.2: v58.2,31.05 54.05,26.9 54.05,9.85 50.45,6.25 X1.150
PA7  (via drill 0.4)
  Top 0.2: IC3.71 57.74,29.95 v58.55,29.95
  Bottom 0.2: v58.55,29.95 58.55,29.9 54.4,25.75 54.4,9.7 51.05,6.35 X1.152
PB0  (via drill 0.4)
  Top 0.2: RN2.6 45.65,11.1 46.05,11.5 48.4,11.5 48.55,11.35 49.04,11.35 IC3.19 50.55,12.86 50.55,13.7 49.8,14.45 49.8,15.4 49.05,16.15 49.05,17.6 50,18.55 v50.95,18.55
  Route15 0.2: v65.85,3.6 65.85,4.5 65.7,4.65 65.15,4.65 64.4,5.4 64.4,6.9 66.75,9.25 66.75,15.8 65.2,17.35 51.85,17.35 51.65,17.55 51.65,17.85 v50.95,18.55
  Bottom 0.2: X1.200 65.45,3.25 65.8,3.6 v65.85,3.6
PB1  (via drill 0.4)
  Top 0.2: 46.48,10.85 RN2.5 47.33,10.88 47.5,11.05 48.3,11.05 48.5,10.85 49.25,10.85 IC3.20 50.9,12.5 50.9,13.85 50.15,14.6 50.15,15.55 49.45,16.25 49.45,17.45 49.85,17.85 50.35,17.85 50.55,17.65 v50.9,17.65
  Route15 0.2: v64.85,3.75 64.85,4.45 64,5.3 64,7.15 66.35,9.5 66.35,15.7 65.05,17 51.55,17 v50.9,17.65
  Bottom 0.2: X1.198 v64.85,3.75
PB2  (via drill 0.4)
  Top 0.2: IC3.21 49.41,10.3 v47.95,10.3 | v45.2,11.9 44.85,11.55 RN2.7
  Route15 0.2: v45.2,11.9 46.8,10.3 v47.95,10.3 48.05,10.3 54,4.35 v64,4.35
  Bottom 0.2: v64,4.35 64,3.15 64.25,2.9 X1.196
PB3  (via drill 0.4)
  Top 0.2: IC3.22 49.46,9.65 v47.3,9.65 | v44.7,12.7 44.55,12.55 R4.2
  Route15 0.2: v63.35,3.6 62.95,4 53.85,4 48.2,9.65 v47.3,9.65 47.3,9.95 46.65,9.95 45.35,11.25 44.9,11.25 44.55,11.6 44.55,12.55 v44.7,12.7
  Bottom 0.2: v63.35,3.6 63.35,3.15 63.6,2.9 63.6,1.45 X1.194
PB4  (via drill 0.4)
  Top 0.2: IC3.23 51.9,11.38 51.9,11.75 51.25,12.4 51.25,14 50.5,14.75 50.5,15.7 50.1,16.1 v50.1,17.2
  Bottom 0.2: X1.130 44.45,5.25 45.45,6.25 45.45,9.2 50.1,13.85 v50.1,17.2
PB5  (via drill 0.4)
  Top 0.2: IC3.24 52.25,11.02 52.25,11.9 51.6,12.55 51.6,14.15 51,14.75 51,16.4 v50.9,16.5
  Bottom 0.2: X1.132 45.05,5.35 45.8,6.1 45.8,9.05 50.9,14.15 v50.9,16.5
PB6  (via drill 0.4)
  Top 0.2: R14.2 37.93,13.33 37.35,12.75 37.35,11.8 36.75,11.2 36.75,6.7 38.4,5.05 40.25,5.05 40.7,5.5 42.95,5.5 43.45,6 47.4,6 48.35,6.95 48.35,8 48.6,8.25 | 48.6,8.25 49.25,8.9 50.84,8.9 IC3.25 | v47.9,8.95 48.6,8.25
  Bottom 0.2: X1.134 45.65,5.45 46.6,6.4 46.6,8.15 47.4,8.95 v47.9,8.95
PC0  (via drill 0.4)
  Top 0.2: IC3.53 61.77,21.25 59.45,21.25 59.15,20.95 v58.95,20.95
  Bottom 0.2: v58.95,20.95 58.65,20.65 57.7,20.65 57.2,20.15 57.2,8.45 54.1,5.35 54.1,4.9 55.85,3.15 X1.168
PC1  (via drill 0.4)
  Top 0.2: v58.1,21.3 58.45,21.65 61.45,21.65 62.27,22.48 IC3.54
  Bottom 0.2: X1.166 55.25,3.15 53.75,4.65 53.75,5.55 56.85,8.65 56.85,20.35 57.8,21.3 v58.1,21.3
PC2  (via drill 0.4)
  Top 0.2: v57.3,21.7 57.6,22 61.1,22 61.93,22.83 IC3.55
  Bottom 0.2: X1.164 54.65,3.15 53.4,4.4 53.4,5.7 56.5,8.8 56.5,20.9 v57.3,21.7
PC3  (via drill 0.4)
  Top 0.2: IC3.56 60.75,22.35 58.1,22.35 57.8,22.65 v57.3,22.65
  Bottom 0.2: X1.162 54.05,3.15 53.05,4.15 53.05,5.85 56.15,8.95 56.15,21.5 v57.3,22.65
PC4  (via drill 0.4)
  Top 0.2: IC3.57 60.39,22.7 58.25,22.7 57.4,23.55 v57.3,23.55
  Bottom 0.2: X1.160 53.45,3.15 52.7,3.9 52.7,6 55.8,9.1 55.8,22.2 57.15,23.55 v57.3,23.55
PC5  (via drill 0.4)
  Top 0.2: IC3.58 60.04,23.05 58.7,23.05 57.55,24.2 v56.5,24.2
  Bottom 0.2: X1.158 52.85,3.15 52.35,3.65 52.35,6.15 55.45,9.25 55.45,23.15 v56.5,24.2
PC6  (via drill 0.4)
  Top 0.2: IC3.59 59.73,23.45 58.9,23.45 57.45,24.9 v57.05,24.9
  Bottom 0.2: v57.05,24.9 56.3,24.9 55.1,23.7 55.1,9.4 52,6.3 52,3.45 52.25,3.2 X1.156
PC7  (via drill 0.4)
  Top 0.2: IC3.60 59.42,23.85 59.15,23.85 57.4,25.6 v56.25,25.6
  Bottom 0.2: v56.25,25.6 54.75,24.1 54.75,9.55 51.65,6.45 X1.154
PD7  (via drill 0.4)
  Top 0.2: IC3.50 62.7,19.25 62.35,19.25 62.1,19 60.25,19 v59.6,18.35
  Bottom 0.2: v59.6,18.35 59.95,18 59.95,6.75 56.45,3.25 X1.170
PE0  (via drill 0.4)
  Top 0.2: v46.45,21.1 46.1,21.1 44.65,19.65 44.65,18.98 IC3.2 43.12,17.45 42.8,17.45 38,22.25 38,23.7 36.1,25.6 RN4.2
  Bottom 0.2: X1.110 38.45,4.25 41.95,7.75 41.95,15.4 43.05,16.5 43.05,18.05 46.1,21.1 v46.45,21.1
PE1  (via drill 0.4)
  Top 0.2: v46.15,20.2 45,19.05 45,18.65 44.26,17.91 IC3.3 43.38,17 42.6,17 37.55,22.05 37.55,23.5 36.25,24.8 RN4.1
  Bottom 0.2: X1.112 39.05,4.35 42.3,7.6 42.3,15.2 43.4,16.3 43.4,17.9 45.7,20.2 v46.15,20.2
PE3  (via drill 0.4)
  Top 0.2: IC3.5 45.6,17.81 45.6,19 46.15,19.55 46.4,19.55 47.75,20.9 v47.8,20.9
  Bottom 0.2: X1.120 41.45,4.75 43.7,7 43.7,14.55 46.5,17.35 46.8,17.35 48.05,18.6 48.05,19.65 47.8,19.9 v47.8,20.9
PE4  (via drill 0.4)
  Top 0.2: IC3.6 46.25,17.75 v46.25,18.7
  Bottom 0.2: X1.114 39.65,4.45 42.65,7.45 42.65,15.05 46.25,18.65 v46.25,18.7
PE5  (via drill 0.4)
  Top 0.2: IC3.7 47.05,17.84 v47.05,19.2
  Bottom 0.2: X1.116 40.25,4.55 43,7.3 43,14.9 46.15,18.05 46.5,18.05 47.05,18.6 v47.05,19.2
PG0  (via drill 0.4)
  Top 0.2: IC3.51 62.13,20.2 v61.75,20.2
  Bottom 0.2: X1.176 58.25,3.55 61,6.3 61,19.45 v61.75,20.2
PG1  (via drill 0.4)
  Top 0.2: IC3.52 62.08,20.85 61.5,20.85 v60.65,20
  Bottom 0.2: X1.174 57.65,3.45 60.65,6.45 v60.65,20
PG2  (via drill 0.4)
  Top 0.2: IC3.70 57.3,28.8 62.05,28.8 63.3,27.55 63.3,24.75 64.6,23.45 64.6,22 61.95,19.35 v59.65,19.35
  Bottom 0.2: X1.172 57.05,3.35 60.3,6.6 60.3,18.7 v59.65,19.35
PG5  (via drill 0.4)
  Top 0.2: IC3.1 44.25,19.3 44.25,19.8 46.4,21.95 v46.75,21.95
  Bottom 0.2: X1.118 40.85,4.65 43.35,7.15 43.35,14.75 46.3,17.7 46.65,17.7 47.7,18.75 47.7,19.5 47.1,20.1 47.1,21.6 v46.75,21.95
PH3  (via drill 0.4)
  Top 0.2: v47.35,16.85 49.1,15.1 49.1,14.25 IC3.15
  Bottom 0.2: X1.122 42.05,4.85 44.05,6.85 44.05,14.4 46.5,16.85 v47.35,16.85
PH4  (via drill 0.4)
  Top 0.2: IC3.16 48.22,12.65 47.35,12.65 47.2,12.8 46.6,12.8 v46.05,12.25
  Bottom 0.2: X1.124 42.65,4.95 44.4,6.7 44.4,9.65 45.95,11.2 45.95,12.15 v46.05,12.25
PH5  (via drill 0.4)
  Top 0.2: v46.95,12.15 47.05,12.05 48.35,12.05 49.21,12.91 IC3.17
  Bottom 0.2: X1.126 43.25,5.05 44.75,6.55 44.75,9.5 46.95,11.7 v46.95,12.15
PH6  (via drill 0.4)
  Top 0.2: IC3.18 49.56,12.61 50.2,13.25 50.2,13.55 49.45,14.3 49.45,15.25 48.4,16.3 v48.4,17.05
  Bottom 0.2: X1.128 43.85,5.15 45.1,6.4 45.1,9.35 48.4,12.65 v48.4,17.05
PL0  (via drill 0.4)
  Top 0.2: v64.1,10 63.4,10 62.3,11.1 60.35,11.1 58.95,12.5 58.85,12.5 58.07,13.28 IC3.35
  Bottom 0.2: X1.192 63.05,2.85 62.7,3.2 62.7,4 63.8,5.1 63.8,9.7 v64.1,10
PL1  (via drill 0.4)
  Top 0.2: v63.75,10.8 63.3,10.8 62.65,11.45 60.55,11.45 59,13 59,13.04 IC3.36
  Bottom 0.2: v63.75,10.8 63.45,10.5 63.45,5.25 62.35,4.15 62.35,2.75 62.4,2.7 62.4,1.45 X1.190
PL2  (via drill 0.4)
  Top 0.2: IC3.37 59.35,13.4 59.35,13.2 60.75,11.8 63.15,11.8 63.5,11.45 64.35,11.45 v64.5,11.3
  Bottom 0.2: X1.188 61.85,4.15 63.1,5.4 63.1,11.2 63.35,11.45 64.35,11.45 v64.5,11.3
PL3  (via drill 0.4)
  Top 0.2: IC3.38 | IC3.38 59.7,13.75 59.7,13.4 60.95,12.15 63.75,12.15 v63.8,12.1
  Bottom 0.2: X1.186 61.25,4.05 62.75,5.55 62.75,11.85 63,12.1 v63.8,12.1
PL4  (via drill 0.4)
  Top 0.2: IC3.39 60.05,14.1 60.05,13.6 61.15,12.5 63.25,12.5 v63.75,13
  Bottom 0.2: X1.184 60.65,3.95 62.4,5.7 62.4,12.15 62.75,12.5 63.25,12.5 v63.75,13
PL5  (via drill 0.4)
  Top 0.2: v62.85,13.2 62.5,12.85 61.35,12.85 60.4,13.8 60.4,14.46 IC3.40
  Bottom 0.2: X1.182 60.05,3.85 62.05,5.85 62.05,12.4 v62.85,13.2
PL6  (via drill 0.4)
  Top 0.2: v62,13.5 61.3,13.5 60.75,14.05 60.75,14.82 IC3.41
  Bottom 0.2: X1.180 59.45,3.75 61.7,6 61.7,13.2 v62,13.5
PL7  (via drill 0.4)
  Top 0.2: v61.65,14.35 61.65,14.63 IC3.42
  Bottom 0.2: X1.178 58.85,3.65 61.35,6.15 61.35,14.05 v61.65,14.35
RD+
  Top 0.2: U5.29 15.75,23.45 15.85,23.35 15.85,22.8 15.7,22.65 15.7,22.32 R13.2
RD-
  Top 0.2: R13.1 16.25,22.38 U5.30
RXD1
  Top 0.2: IC3.45 62.15,16.25 62.5,16.25 66,12.75 66,9.95 62.9,6.85 62.9,5.95 61.55,4.6 X1.187
RXD2  (via drill 0.4)
  Top 0.2: IC3.12 46.79,14.05 46.55,14.05 v45.55,13.05 | v54.85,5.05 54.95,4.95 X1.165
  Route15 0.2: v45.55,13.05 46.3,13.05 46.55,12.8 47.2,12.8 48.65,11.35 48.65,10.2 53.8,5.05 v54.85,5.05
RXD3  (via drill 0.4)
  Top 0.2: X1.169 56.15,4.8 v56.4,5.05 | IC3.63 59.95,26.5 v59.95,28.15
  Bottom 0.2: v56.4,5.05 57.75,5.05 59.6,6.9 59.6,17.45 58.95,18.1 58.95,19.55 59.95,20.55 v59.95,28.15
RXL
  Top 0.2: D5.- 9.95,30.6 10.4,31.05 16.15,31.05 16.8,30.4 16.8,28.95 U5.10
SCL
  Top 0.2: IC3.43 61.44,15.55 62.2,15.55 65.3,12.45 65.3,10.25 62.1,7.05 62.1,6.15 60.35,4.4 X1.183
SCLK_3V3
  Top 0.2: U2.23 41.45,6.3 41.85,5.9 42.75,5.9 43.15,6.3 43.15,6.7 43.8,7.35 46.15,7.35 46.45,7.65 RN6.1 RN2.4
SDA
  Top 0.2: IC3.44 61.79,15.9 62.35,15.9 65.65,12.6 65.65,10.1 62.5,6.95 62.5,6.05 60.95,4.5 X1.185
TXD1
  Top 0.2: IC3.46 62.51,16.6 62.65,16.6 66.35,12.9 66.35,9.8 63.3,6.75 63.3,5.85 62.15,4.7 X1.189
TXD2  (via drill 0.4)
  Top 0.2: IC3.13 46.9,13.45 v46.85,13.45 | v55.8,5.7 55.55,5.45 X1.167
  Route15 0.2: v46.85,13.45 47.15,13.15 47.35,13.15 49,11.5 49,10.35 53.65,5.7 v55.8,5.7
TXD3  (via drill 0.4)
  Top 0.2: X1.171 56.75,4.5 57.1,4.85 v57.1,5.75 | IC3.64 59.35,26.61 59.35,27.25 59,27.6 v59,27.8
  Bottom 0.2: v57.1,5.75 57.95,5.75 59.25,7.05 59.25,17.3 58.6,17.95 58.6,19.7 59.6,20.7 59.6,27.2 v59,27.8
TXL
  Top 0.2: U5.11 16.25,29.55 16.45,29.75 16.45,30.25 16,30.7 11.75,30.7 11.5,30.45 D6.-
USB2AX1_HWB
  Top 0.2: X1.49 20.15,3.7 22.8,6.35 24.25,6.35 26.55,8.65 26.55,10.9 U1.13
USB2AX1_MISO
  Top 0.2: U1.17 28.25,12.31 28.25,7.45 25.55,4.75 23.7,4.75 22.55,3.6 X1.57
USB2AX1_MOSI
  Top 0.2: U1.16 27.85,11.72 27.85,7.75 25.2,5.1 23.5,5.1 21.95,3.55 X1.55
USB2AX1_RST  (via drill 0.4)
  Top 0.2: X1.47 19.55,3.8 22.5,6.75 | 22.5,6.75 24.05,6.75 24.35,7.05 v24.35,7.95 | U1.24 24.77,16.55 25.55,16.55 29.3,12.8 v29.3,11.9 | R16.2 C41.1 22.4,6.85 22.5,6.75
  Bottom 0.2: v24.35,7.95 24.85,7.95 25.05,7.75 25.65,7.75 26.55,8.65 26.55,9.15 v29.3,11.9
USB2AX1_RX
  Top 0.2: R2.5 31.39,15.74 30.45,14.8 30.45,11.6 30,11.15 30,10.6 29.15,9.75 29.15,7.1 26.05,4 25.25,4 24.35,3.1 X1.63
USB2AX1_SCK
  Top 0.2: U1.15 27.45,11.42 27.45,8.15 24.8,5.5 23.25,5.5 21.35,3.6 X1.53
USB2AX1_SS
  Top 0.2: U1.14 27,11.16 27,8.45 24.5,5.95 23.05,5.95 20.75,3.65 X1.51
USB2AX1_TX/DATA
  Top 0.3: X1.65 24.95,3 25.5,3.55 26.35,3.55 29.55,6.75 RPTC1.2
USB2AX1_TXRX_DIR
  Top 0.2: U1.19 26.46,14.7 26.85,14.7 28.65,12.9 28.65,7.15 25.85,4.35 24.85,4.35 23.75,3.25 X1.61
USB2AX2_HWB  (via drill 0.4)
  Top 0.2: U4.13 26,25 v26.6,25
  Bottom 0.2: v26.6,25 25.25,23.65 25.25,20.4 24.9,20.05 24.9,16.35 23.9,15.35 23.9,12.65 23.4,12.15 23.4,9.25 22.95,8.8 22.95,6.1 25.25,3.8 X1.66
USB2AX2_MISO  (via drill 0.4)
  Top 0.2: U4.17 22.95,25.11 23.2,25.35 23.2,25.9 v23.5,26.2
  Bottom 0.2: v23.5,26.2 23.5,21.05 22.75,20.3 22.75,18.35 22.25,17.85 22.25,13.45 20.05,11.25 20.05,10.65 21.3,9.4 21.3,5.2 22.85,3.65 X1.58
USB2AX2_MOSI  (via drill 0.4)
  Top 0.2: U4.16 24.45,25.57 v24.45,26.5
  Bottom 0.2: v24.45,26.5 24.45,25.8 23.9,25.25 23.9,20.9 23.1,20.1 23.1,18.15 22.65,17.7 22.65,13.25 22.15,12.75 22.15,9.8 21.7,9.35 21.7,5.4 23.45,3.65 X1.60
USB2AX2_RST  (via drill 0.4)
  Top 0.2: C40.1 R17.2 19.79,23.29 U4.24 20.25,22.59 v19.8,22.15 | v28.55,14.7 28.55,14.15 29.95,12.75 29.95,11.65 29.35,11.05 v29.35,10.85
  Bottom 0.2: v19.8,22.15 19.8,22.9 22.85,25.95 22.85,26.45 23.55,27.15 25.75,27.15 27.65,25.25 27.65,22.2 26.45,21 26.45,20.5 27.1,19.85 27.1,16.15 v28.55,14.7 | v29.35,10.85 29.25,10.85 28.55,10.15 28.55,9.7 25.85,7 X1.68
USB2AX2_RX
  Top 0.2: R2.7 33,16.82 33,16.2 32.65,15.85 32.65,5.9 31.25,4.5 28.6,4.5 26.75,2.65 X1.71
USB2AX2_SCK  (via drill 0.4)
  Top 0.2: U4.15 25.25,25.67 v25.25,25.85
  Bottom 0.2: v25.25,25.85 25.25,25.2 24.35,24.3 24.35,20.75 23.55,19.95 23.55,17.9 23.1,17.45 23.1,13.05 22.6,12.55 22.6,9.65 22.1,9.15 22.1,5.7 24.05,3.75 X1.62
USB2AX2_SS  (via drill 0.4)
  Top 0.2: U4.14 25.44,25.15 25.6,25.15 26.2,25.75 v26.2,25.8
  Bottom 0.2: v26.2,25.8 26.2,25.55 24.8,24.15 24.8,20.55 24.5,20.25 24.5,16.45 23.55,15.5 23.55,12.85 23.05,12.35 23.05,9.5 22.55,9 22.55,5.95 24.65,3.85 X1.64
USB2AX2_TX/DATA
  Top 0.3: RPTC2.2 33.95,6.15 31.8,4 28.75,4 27.35,2.6 X1.73
USB2AX2_TXRX_DIR  (via drill 0.4)
  Top 0.2: U4.19 22.24,24.36 v21.3,25.3 | v31.5,11.85 v31.5,14.9 | v29,5.15 28.7,5.15 26.15,2.6 X1.69
  Bottom 0.2: v21.3,25.3 21.3,25.45 23.35,27.5 25.95,27.5 29.8,23.65 31.35,23.65 33.05,21.95 33.05,16.45 v31.5,14.9 | v31.5,11.85 30.15,10.5 29.9,10.5 29,9.6 v29,5.15
USB2SER_DTR  (via drill 0.4)
  Top 0.2: U5.13 15.25,29.45 v15.8,30 | v27.75,27.55 29,27.55 29.38,27.93 C14.1 29.48,28.4 RN3.4
  Bottom 0.2: v15.8,30 15.8,26.6 18.6,23.8 | X1.54 21.65,3.75 20,5.4 20,10.1 19.55,10.55 19.55,11.3 19.85,11.6 19.85,12.6 19.35,13.1 19.35,21.5 18.85,22 18.85,23.55 18.6,23.8 | 18.6,23.8 18.85,23.8 22.95,27.9 27.4,27.9 v27.75,27.55
USB2SER_MISO  (via drill 0.4)
  Top 0.2: U5.17 13.05,28.6 v12.5,29.15
  Bottom 0.2: X1.46 19.25,3.85 18.55,4.55 18.55,8.8 17.2,10.15 17.2,21 16.15,22.05 16.15,23.8 13.5,26.45 13.5,28.15 v12.5,29.15
USB2SER_MOSI  (via drill 0.4)
  Top 0.2: U5.16 13.75,29.3 v13.05,30
  Bottom 0.2: X1.48 19.85,3.75 18.95,4.65 18.95,9.15 17.65,10.45 17.65,21.2 16.55,22.3 16.55,23.95 13.95,26.55 13.95,28.25 13.35,28.85 13.35,29.35 13.05,29.65 v13.05,30
USB2SER_RESET  (via drill 0.4)
  Top 0.2: C39.1 R18.2
  Top 0.3: C39.1 v12.1,24.7 U5.24
  Bottom 0.2: X1.44 18.65,3.9 18.15,4.4 18.15,8.6 16.8,9.95 16.8,20 v12.1,24.7
USB2SER_SCK  (via drill 0.4)
  Top 0.2: U5.15 14.25,29.7 v13.95,30
  Bottom 0.2: X1.50 20.45,3.7 19.3,4.85 19.3,9.45 18.05,10.7 18.05,12.45 18.4,12.8 18.4,21.05 17,22.45 17,24.1 14.45,26.65 14.45,28.75 13.95,29.25 v13.95,30
USB2SER_SS  (via drill 0.4)
  Top 0.2: U5.14 14.75,29.85 v14.9,30
  Bottom 0.2: v14.9,30 14.9,26.8 17.4,24.3 17.4,22.7 18.85,21.25 18.85,13 19.45,12.4 19.45,11.8 19.15,11.5 19.15,10.35 19.65,9.85 19.65,5.1 21.05,3.7 X1.52
USBDM_DN1
  Top 0.2: U3.1 14.65,14.5 14.97,14.18 R1.4
USBDM_DN2
  Top 0.2: U3.3 13.34,15.51 13.4,15.45 16.65,15.45 17.35,16.15 17.55,16.15 R3.4
USBDM_DN3
  Top 0.2: U3.6 13.56,17.01 16.32,19.77 R13.4
USBDM_UP
  Top 0.2: U3.30 8.56,13.03 arc21 8.59,12.86 8.59,12.85 arc-21 8.65,12.54 8.65,9.74 arc-45 7.91,7.96 4.47,4.53 arc47 4.05,3.45 4.05,1.5 X1.7
USBDP_DN1
  Top 0.2: U3.2 14.8,15 14.97,14.82 R1.3
USBDP_DN2
  Top 0.2: U3.4 13.41,15.99 13.55,15.85 16.5,15.85 17.05,16.4 17.05,16.55 R3.3
USBDP_DN3
  Top 0.2: U3.7 13.49,17.49 15.68,19.68 R13.3
USBDP_UP
  Top 0.2: U3.31 9.04,9.76 arc-45 8.18,7.69 4.78,4.33 arc47 4.45,3.5 4.45,1.5 X1.9
VUCAP
  Top 0.2: U5.27 14.75,23.6 14.5,23.35 14.5,22.38 C17.2
XT1
  Top 0.2: U5.2 19.2,25.2 19.95,25.95 19.95,27.44 C19.1 20.79,28.28 Q3.P$3
XT2
  Top 0.2: U5.1 19.3,24.7 20.4,25.8 20.4,26.57 C18.1 21.01,27.21 21.15,27.35 21.15,28.05 21.9,28.8 23.28,28.8 Q3.P$1
XTAL1
  Top 0.2: IC3.34 58.57,12.05 58.8,12.05 60.7,10.15 C24.1 60.7,8.99 Q2.P$3
XTAL2
  Top 0.2: IC3.33 58.26,11.65 58.45,11.65 59.74,10.36 C25.1 59.74,9.66 59.75,9.65 59.75,8.34 Q2.P$1

## Text on the board
tPlace: RX | TX | PWR | LED | DXL2 | X | Z | Y | DXL1 | 1 | 39 | Poppy IO module v1.1 | www.poppy-project.org | 199
bPlace: Poppy IO module v1.1 | SJ2 | SJ1 | RST-EN | www.poppy-project.org | Design by Nicolas Saugnier | 40 | 2 | 200